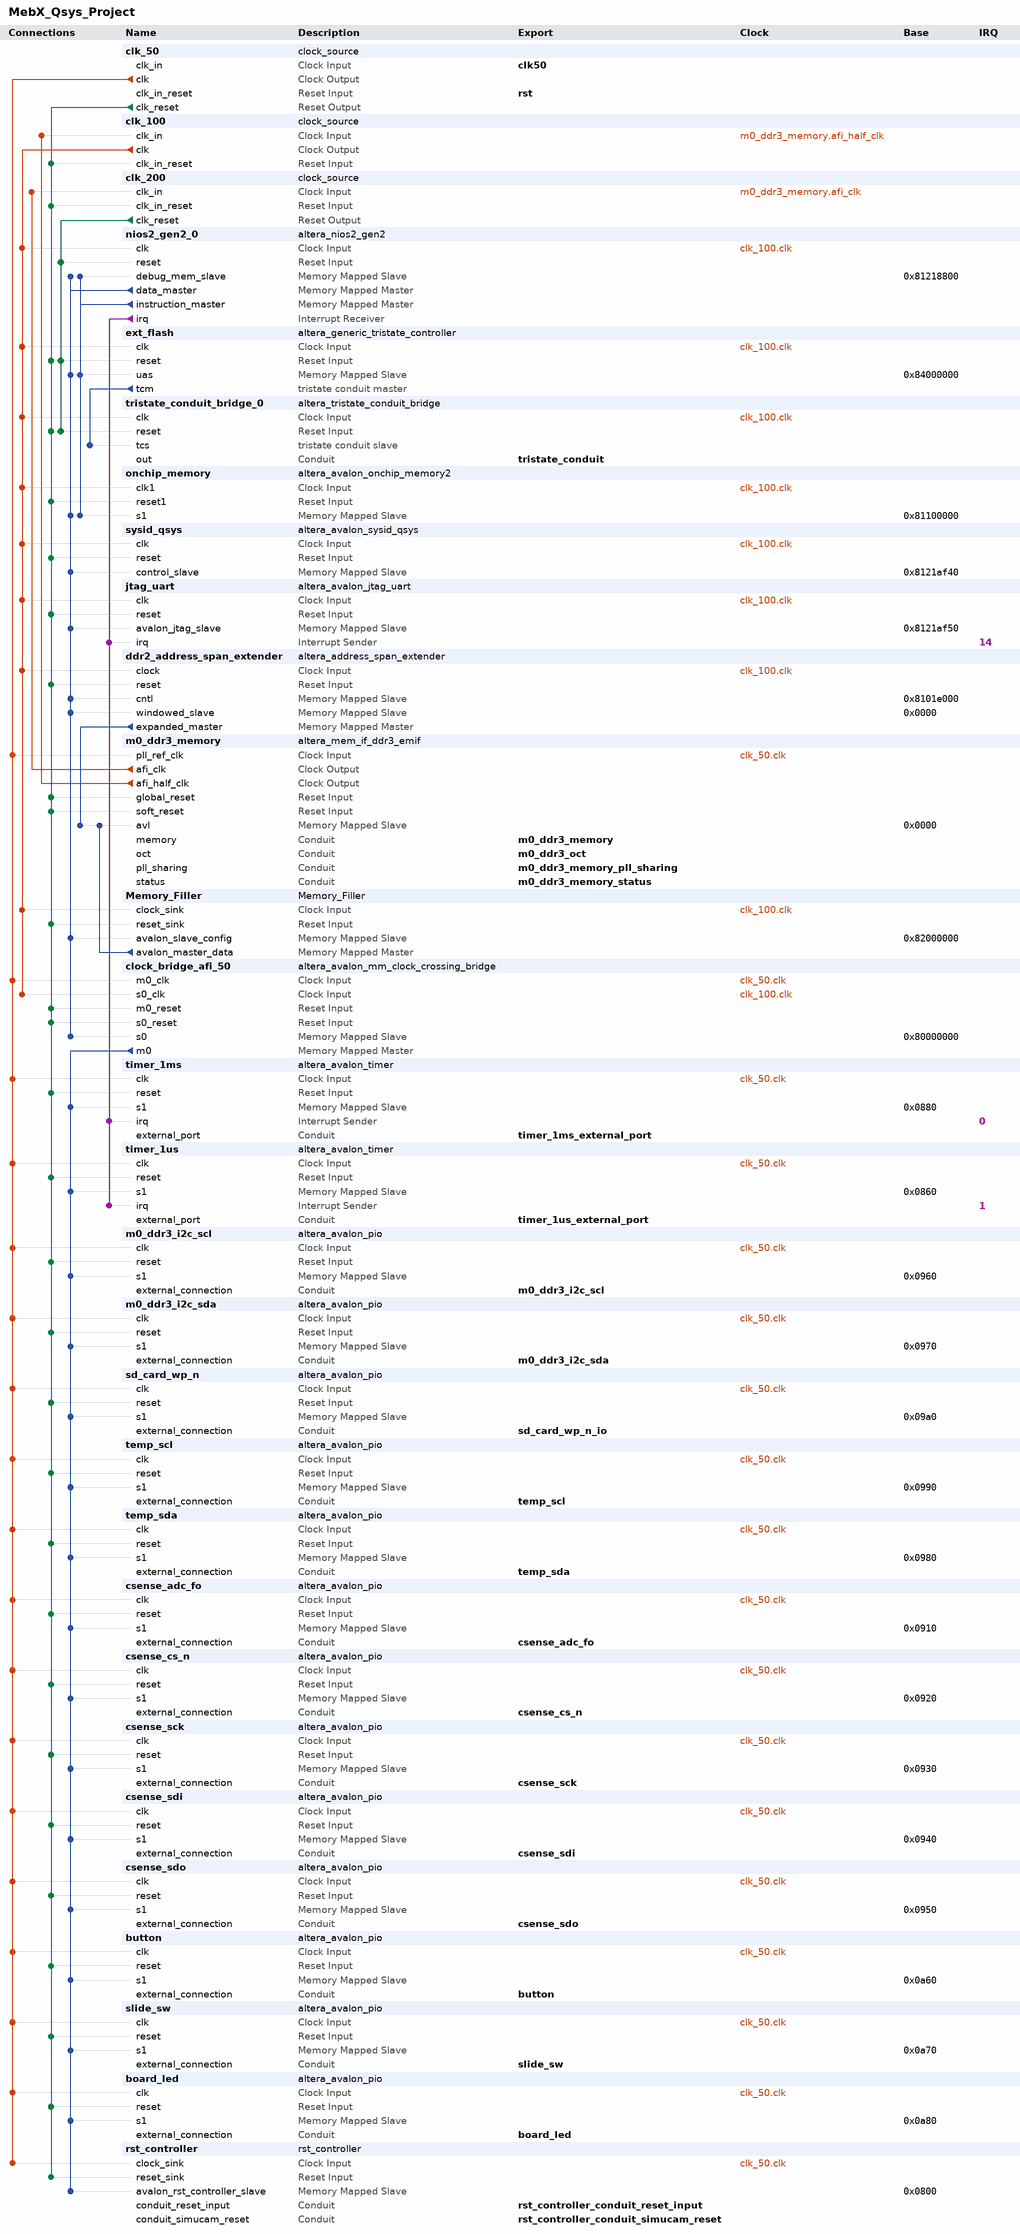
[diagram p0: system contents]
# Platform Designer (Qsys) system MebX_Qsys_Project, Stratix IV EP4SGX530KH40C2
# Parameters at their usual value, and those the tool derives, are not listed.
package require -exact qsys 18.1
create_system MebX_Qsys_Project
set_project_property DEVICE_FAMILY {Stratix IV}
set_project_property DEVICE EP4SGX530KH40C2

add_instance clk_50 clock_source 18.1
set_instance_parameter_value clk_50 clockFrequency 50000000

add_instance clk_100 clock_source 18.1
set_instance_parameter_value clk_100 clockFrequency 100000000

add_instance clk_200 clock_source 18.1
set_instance_parameter_value clk_200 clockFrequency 200000000

add_instance nios2_gen2_0 altera_nios2_gen2 18.1
set_instance_parameter_value nios2_gen2_0 dcache_size 0
set_instance_parameter_value nios2_gen2_0 debug_hwbreakpoint 2
set_instance_parameter_value nios2_gen2_0 dividerType srt2
set_instance_parameter_value nios2_gen2_0 exceptionSlave onchip_memory.s1
set_instance_parameter_value nios2_gen2_0 icache_burstType Sequential
set_instance_parameter_value nios2_gen2_0 icache_size 4096
set_instance_parameter_value nios2_gen2_0 impl Fast
set_instance_parameter_value nios2_gen2_0 mul_64_impl 1
set_instance_parameter_value nios2_gen2_0 mul_shift_choice 1
set_instance_parameter_value nios2_gen2_0 resetOffset 33685504
set_instance_parameter_value nios2_gen2_0 resetSlave ext_flash.uas
set_instance_parameter_value nios2_gen2_0 setting_support31bitdcachebypass false

add_instance ext_flash altera_generic_tristate_controller 18.1
set_instance_parameter_value ext_flash ACTIVE_LOW_BEGINTRANSFER 0
set_instance_parameter_value ext_flash ACTIVE_LOW_BYTEENABLE 0
set_instance_parameter_value ext_flash ACTIVE_LOW_OUTPUTENABLE 0
set_instance_parameter_value ext_flash ACTIVE_LOW_READ 1
set_instance_parameter_value ext_flash CHIPSELECT_THROUGH_READLATENCY 0
set_instance_parameter_value ext_flash INTERFACE_ASSIGNMENT_KEYS embeddedsw.configuration.isFlash,embeddedsw.configuration.isNonVolatileStorage,embeddedsw.configuration.isMemoryDevice
set_instance_parameter_value ext_flash INTERFACE_ASSIGNMENT_VALUES 1,1,1
set_instance_parameter_value ext_flash MODULE_ASSIGNMENT_KEYS embeddedsw.configuration.hwClassnameDriverSupportList,embeddedsw.configuration.hwClassnameDriverSupportDefault,embeddedsw.CMacro.SETUP_VALUE,embeddedsw.CMacro.WAIT_VALUE,embeddedsw.CMacro.HOLD_VALUE,embeddedsw.CMacro.TIMING_UNITS,embeddedsw.CMacro.SIZE,embeddedsw.memoryInfo.MEM_INIT_DATA_WIDTH,embeddedsw.memoryInfo.HAS_BYTE_LANE,embeddedsw.memoryInfo.IS_FLASH,embeddedsw.memoryInfo.GENERATE_DAT_SYM,embeddedsw.memoryInfo.GENERATE_FLASH,embeddedsw.memoryInfo.DAT_SYM_INSTALL_DIR,embeddedsw.memoryInfo.FLASH_INSTALL_DIR
set_instance_parameter_value ext_flash MODULE_ASSIGNMENT_VALUES "altera_avalon_lan91c111\\,altera_avalon_cfi_flash,altera_avalon_cfi_flash,25,100,20,\"ns\",33554432u,16,1,1,1,1,SIM_DIR,APP_DIR"
set_instance_parameter_value ext_flash TCM_ADDRESS_W 26
set_instance_parameter_value ext_flash TCM_BYTEENABLE_W 2
set_instance_parameter_value ext_flash TCM_DATA_HOLD 20
set_instance_parameter_value ext_flash TCM_DATA_W 16
set_instance_parameter_value ext_flash TCM_MAX_PENDING_READ_TRANSACTIONS 3
set_instance_parameter_value ext_flash TCM_READLATENCY 2
set_instance_parameter_value ext_flash TCM_READ_WAIT 100
set_instance_parameter_value ext_flash TCM_SETUP_WAIT 25
set_instance_parameter_value ext_flash TCM_SYMBOLS_PER_WORD 2
set_instance_parameter_value ext_flash TCM_TIMING_UNITS 0
set_instance_parameter_value ext_flash TCM_TURNAROUND_TIME 2
set_instance_parameter_value ext_flash TCM_WRITE_WAIT 100
set_instance_parameter_value ext_flash USE_BEGINTRANSFER 0
set_instance_parameter_value ext_flash USE_BYTEENABLE 0
set_instance_parameter_value ext_flash USE_OUTPUTENABLE 0
set_instance_parameter_value ext_flash USE_READ 1

add_instance tristate_conduit_bridge_0 altera_tristate_conduit_bridge 18.1

add_instance onchip_memory altera_avalon_onchip_memory2 18.1
set_instance_parameter_value onchip_memory blockType M9K
set_instance_parameter_value onchip_memory dataWidth 32
set_instance_parameter_value onchip_memory dualPort false
set_instance_parameter_value onchip_memory initMemContent false
set_instance_parameter_value onchip_memory initializationFileName onchip_mem.hex
set_instance_parameter_value onchip_memory memorySize 786432

add_instance sysid_qsys altera_avalon_sysid_qsys 18.1
set_instance_parameter_value sysid_qsys id 113

add_instance jtag_uart altera_avalon_jtag_uart 18.1
set_instance_parameter_value jtag_uart simInteractiveOptions NO_INTERACTIVE_WINDOWS

add_instance ddr2_address_span_extender altera_address_span_extender 18.1
set_instance_parameter_value ddr2_address_span_extender BURSTCOUNT_WIDTH 8
set_instance_parameter_value ddr2_address_span_extender DATA_WIDTH 32
set_instance_parameter_value ddr2_address_span_extender ENABLE_SLAVE_PORT true
set_instance_parameter_value ddr2_address_span_extender MASTER_ADDRESS_DEF 0
set_instance_parameter_value ddr2_address_span_extender MAX_PENDING_READS 8
set_instance_parameter_value ddr2_address_span_extender SLAVE_ADDRESS_WIDTH 29

add_instance m0_ddr3_memory altera_mem_if_ddr3_emif 18.1
set_instance_parameter_value m0_ddr3_memory AVL_MAX_SIZE 8
set_instance_parameter_value m0_ddr3_memory CALIBRATION_MODE Full
set_instance_parameter_value m0_ddr3_memory CPORT_TYPE_PORT Bidirectional,Bidirectional,Bidirectional,Bidirectional,Bidirectional,Bidirectional
set_instance_parameter_value m0_ddr3_memory EXPORT_AFI_HALF_CLK true
set_instance_parameter_value m0_ddr3_memory HARD_EMIF false
set_instance_parameter_value m0_ddr3_memory MEM_ASR Automatic
set_instance_parameter_value m0_ddr3_memory MEM_ATCL CL-1
set_instance_parameter_value m0_ddr3_memory MEM_BANKADDR_WIDTH 3
set_instance_parameter_value m0_ddr3_memory MEM_CK_WIDTH 2
set_instance_parameter_value m0_ddr3_memory MEM_CLK_FREQ 533.33
set_instance_parameter_value m0_ddr3_memory MEM_CLK_FREQ_MAX 533.333
set_instance_parameter_value m0_ddr3_memory MEM_COL_ADDR_WIDTH 10
set_instance_parameter_value m0_ddr3_memory MEM_DQ_WIDTH 64
set_instance_parameter_value m0_ddr3_memory MEM_FORMAT UNBUFFERED
set_instance_parameter_value m0_ddr3_memory MEM_ROW_ADDR_WIDTH 15
set_instance_parameter_value m0_ddr3_memory MEM_TCL 7
set_instance_parameter_value m0_ddr3_memory MEM_TFAW_NS 37.5
set_instance_parameter_value m0_ddr3_memory MEM_TRAS_NS 37.5
set_instance_parameter_value m0_ddr3_memory MEM_TRCD_NS 13.125
set_instance_parameter_value m0_ddr3_memory MEM_TRFC_NS 110.0
set_instance_parameter_value m0_ddr3_memory MEM_TRP_NS 13.125
set_instance_parameter_value m0_ddr3_memory MEM_TRRD_NS 13.2
set_instance_parameter_value m0_ddr3_memory MEM_TRTP_NS 13.2
set_instance_parameter_value m0_ddr3_memory MEM_TWTR 4
set_instance_parameter_value m0_ddr3_memory MEM_VENDOR Hynix
set_instance_parameter_value m0_ddr3_memory MEM_WTCL 6
set_instance_parameter_value m0_ddr3_memory PLL_LOCATION Top_Bottom
set_instance_parameter_value m0_ddr3_memory POWER_OF_TWO_BUS false
set_instance_parameter_value m0_ddr3_memory PRIORITY_PORT 1,1,1,1,1,1
set_instance_parameter_value m0_ddr3_memory RATE Half
set_instance_parameter_value m0_ddr3_memory REF_CLK_FREQ 50.0
set_instance_parameter_value m0_ddr3_memory SPEED_GRADE 2
set_instance_parameter_value m0_ddr3_memory TIMING_BOARD_AC_SKEW 0.043
set_instance_parameter_value m0_ddr3_memory TIMING_BOARD_AC_TO_CK_SKEW 0.0
set_instance_parameter_value m0_ddr3_memory TIMING_BOARD_DQ_TO_DQS_SKEW 0.004
set_instance_parameter_value m0_ddr3_memory TIMING_BOARD_MAX_CK_DELAY 1.2
set_instance_parameter_value m0_ddr3_memory TIMING_BOARD_MAX_DQS_DELAY 0.56
set_instance_parameter_value m0_ddr3_memory TIMING_BOARD_SKEW_BETWEEN_DQS 0.05
set_instance_parameter_value m0_ddr3_memory TIMING_BOARD_SKEW_CKDQS_DIMM_MAX 0.7
set_instance_parameter_value m0_ddr3_memory TIMING_BOARD_SKEW_CKDQS_DIMM_MIN 0.33
set_instance_parameter_value m0_ddr3_memory TIMING_BOARD_SKEW_WITHIN_DQS 0.0085
set_instance_parameter_value m0_ddr3_memory TIMING_TDH 100
set_instance_parameter_value m0_ddr3_memory TIMING_TDQSCK 400
set_instance_parameter_value m0_ddr3_memory TIMING_TDQSQ 150
set_instance_parameter_value m0_ddr3_memory TIMING_TDQSS 0.25
set_instance_parameter_value m0_ddr3_memory TIMING_TDS 25
set_instance_parameter_value m0_ddr3_memory TIMING_TDSH 0.2
set_instance_parameter_value m0_ddr3_memory TIMING_TDSS 0.2
set_instance_parameter_value m0_ddr3_memory TIMING_TIH 200
set_instance_parameter_value m0_ddr3_memory TIMING_TIS 125
set_instance_parameter_value m0_ddr3_memory TIMING_TQSH 0.38
set_instance_parameter_value m0_ddr3_memory USER_DEBUG_LEVEL 0

add_instance Memory_Filler Memory_Filler 1.0

add_instance clock_bridge_afi_50 altera_avalon_mm_clock_crossing_bridge 18.1
set_instance_parameter_value clock_bridge_afi_50 ADDRESS_WIDTH 32
set_instance_parameter_value clock_bridge_afi_50 COMMAND_FIFO_DEPTH 4
set_instance_parameter_value clock_bridge_afi_50 DATA_WIDTH 32
set_instance_parameter_value clock_bridge_afi_50 MASTER_SYNC_DEPTH 2
set_instance_parameter_value clock_bridge_afi_50 MAX_BURST_SIZE 1
set_instance_parameter_value clock_bridge_afi_50 RESPONSE_FIFO_DEPTH 4
set_instance_parameter_value clock_bridge_afi_50 SLAVE_SYNC_DEPTH 2
set_instance_parameter_value clock_bridge_afi_50 USE_AUTO_ADDRESS_WIDTH 1

add_instance timer_1ms altera_avalon_timer 18.1
set_instance_parameter_value timer_1ms alwaysRun true
set_instance_parameter_value timer_1ms period 1
set_instance_parameter_value timer_1ms periodUnits MSEC
set_instance_parameter_value timer_1ms timeoutPulseOutput true

add_instance timer_1us altera_avalon_timer 18.1
set_instance_parameter_value timer_1us alwaysRun true
set_instance_parameter_value timer_1us period 1
set_instance_parameter_value timer_1us periodUnits USEC
set_instance_parameter_value timer_1us timeoutPulseOutput true

add_instance m0_ddr3_i2c_scl altera_avalon_pio 18.1
set_instance_parameter_value m0_ddr3_i2c_scl direction Output
set_instance_parameter_value m0_ddr3_i2c_scl width 1

add_instance m0_ddr3_i2c_sda altera_avalon_pio 18.1
set_instance_parameter_value m0_ddr3_i2c_sda direction Bidir
set_instance_parameter_value m0_ddr3_i2c_sda width 1

add_instance sd_card_wp_n altera_avalon_pio 18.1
set_instance_parameter_value sd_card_wp_n direction Input
set_instance_parameter_value sd_card_wp_n width 1

add_instance temp_scl altera_avalon_pio 18.1
set_instance_parameter_value temp_scl direction Output
set_instance_parameter_value temp_scl width 1

add_instance temp_sda altera_avalon_pio 18.1
set_instance_parameter_value temp_sda direction Bidir
set_instance_parameter_value temp_sda width 1

add_instance csense_adc_fo altera_avalon_pio 18.1
set_instance_parameter_value csense_adc_fo direction Output
set_instance_parameter_value csense_adc_fo width 1

add_instance csense_cs_n altera_avalon_pio 18.1
set_instance_parameter_value csense_cs_n direction Output
set_instance_parameter_value csense_cs_n width 2

add_instance csense_sck altera_avalon_pio 18.1
set_instance_parameter_value csense_sck direction Output
set_instance_parameter_value csense_sck width 1

add_instance csense_sdi altera_avalon_pio 18.1
set_instance_parameter_value csense_sdi direction Output
set_instance_parameter_value csense_sdi width 1

add_instance csense_sdo altera_avalon_pio 18.1
set_instance_parameter_value csense_sdo direction Input
set_instance_parameter_value csense_sdo width 1

add_instance button altera_avalon_pio 18.1
set_instance_parameter_value button direction Input
set_instance_parameter_value button width 4

add_instance slide_sw altera_avalon_pio 18.1
set_instance_parameter_value slide_sw direction Input
set_instance_parameter_value slide_sw width 4

add_instance board_led altera_avalon_pio 18.1
set_instance_parameter_value board_led direction Output
set_instance_parameter_value board_led resetValue 15
set_instance_parameter_value board_led width 4

add_instance rst_controller rst_controller 1.6

# connections
add_connection clk_50.clk board_led.clk clock
add_connection clk_50.clk button.clk clock
add_connection clk_50.clk clock_bridge_afi_50.m0_clk clock
add_connection clk_50.clk csense_adc_fo.clk clock
add_connection clk_50.clk csense_cs_n.clk clock
add_connection clk_50.clk csense_sck.clk clock
add_connection clk_50.clk csense_sdi.clk clock
add_connection clk_50.clk csense_sdo.clk clock
add_connection clk_50.clk m0_ddr3_i2c_scl.clk clock
add_connection clk_50.clk m0_ddr3_i2c_sda.clk clock
add_connection clk_50.clk m0_ddr3_memory.pll_ref_clk clock
add_connection clk_50.clk rst_controller.clock_sink clock
add_connection clk_50.clk sd_card_wp_n.clk clock
add_connection clk_50.clk slide_sw.clk clock
add_connection clk_50.clk temp_scl.clk clock
add_connection clk_50.clk temp_sda.clk clock
add_connection clk_50.clk timer_1ms.clk clock
add_connection clk_50.clk timer_1us.clk clock
add_connection clk_100.clk clock_bridge_afi_50.s0_clk clock
add_connection clk_100.clk ddr2_address_span_extender.clock clock
add_connection clk_100.clk ext_flash.clk clock
add_connection clk_100.clk jtag_uart.clk clock
add_connection clk_100.clk Memory_Filler.clock_sink clock
add_connection clk_100.clk nios2_gen2_0.clk clock
add_connection clk_100.clk onchip_memory.clk1 clock
add_connection clk_100.clk sysid_qsys.clk clock
add_connection clk_100.clk tristate_conduit_bridge_0.clk clock
add_connection m0_ddr3_memory.afi_clk clk_200.clk_in clock
add_connection m0_ddr3_memory.afi_half_clk clk_100.clk_in clock
add_connection clk_50.clk_reset board_led.reset reset
add_connection clk_50.clk_reset button.reset reset
add_connection clk_50.clk_reset clk_100.clk_in_reset reset
add_connection clk_50.clk_reset clk_200.clk_in_reset reset
add_connection clk_50.clk_reset clock_bridge_afi_50.m0_reset reset
add_connection clk_50.clk_reset clock_bridge_afi_50.s0_reset reset
add_connection clk_50.clk_reset csense_adc_fo.reset reset
add_connection clk_50.clk_reset csense_cs_n.reset reset
add_connection clk_50.clk_reset csense_sck.reset reset
add_connection clk_50.clk_reset csense_sdi.reset reset
add_connection clk_50.clk_reset csense_sdo.reset reset
add_connection clk_50.clk_reset ddr2_address_span_extender.reset reset
add_connection clk_50.clk_reset ext_flash.reset reset
add_connection clk_50.clk_reset jtag_uart.reset reset
add_connection clk_50.clk_reset m0_ddr3_i2c_scl.reset reset
add_connection clk_50.clk_reset m0_ddr3_i2c_sda.reset reset
add_connection clk_50.clk_reset m0_ddr3_memory.global_reset reset
add_connection clk_50.clk_reset m0_ddr3_memory.soft_reset reset
add_connection clk_50.clk_reset Memory_Filler.reset_sink reset
add_connection clk_50.clk_reset onchip_memory.reset1 reset
add_connection clk_50.clk_reset rst_controller.reset_sink reset
add_connection clk_50.clk_reset sd_card_wp_n.reset reset
add_connection clk_50.clk_reset slide_sw.reset reset
add_connection clk_50.clk_reset sysid_qsys.reset reset
add_connection clk_50.clk_reset temp_scl.reset reset
add_connection clk_50.clk_reset temp_sda.reset reset
add_connection clk_50.clk_reset timer_1ms.reset reset
add_connection clk_50.clk_reset timer_1us.reset reset
add_connection clk_50.clk_reset tristate_conduit_bridge_0.reset reset
add_connection clk_200.clk_reset ext_flash.reset reset
add_connection clk_200.clk_reset nios2_gen2_0.reset reset
add_connection clk_200.clk_reset tristate_conduit_bridge_0.reset reset
add_connection clock_bridge_afi_50.m0 board_led.s1 avalon
set_connection_parameter_value clock_bridge_afi_50.m0/board_led.s1 baseAddress 0x0a80
add_connection clock_bridge_afi_50.m0 button.s1 avalon
set_connection_parameter_value clock_bridge_afi_50.m0/button.s1 baseAddress 0x0a60
add_connection clock_bridge_afi_50.m0 csense_adc_fo.s1 avalon
set_connection_parameter_value clock_bridge_afi_50.m0/csense_adc_fo.s1 baseAddress 0x0910
add_connection clock_bridge_afi_50.m0 csense_cs_n.s1 avalon
set_connection_parameter_value clock_bridge_afi_50.m0/csense_cs_n.s1 baseAddress 0x0920
add_connection clock_bridge_afi_50.m0 csense_sck.s1 avalon
set_connection_parameter_value clock_bridge_afi_50.m0/csense_sck.s1 baseAddress 0x0930
add_connection clock_bridge_afi_50.m0 csense_sdi.s1 avalon
set_connection_parameter_value clock_bridge_afi_50.m0/csense_sdi.s1 baseAddress 0x0940
add_connection clock_bridge_afi_50.m0 csense_sdo.s1 avalon
set_connection_parameter_value clock_bridge_afi_50.m0/csense_sdo.s1 baseAddress 0x0950
add_connection clock_bridge_afi_50.m0 m0_ddr3_i2c_scl.s1 avalon
set_connection_parameter_value clock_bridge_afi_50.m0/m0_ddr3_i2c_scl.s1 baseAddress 0x0960
add_connection clock_bridge_afi_50.m0 m0_ddr3_i2c_sda.s1 avalon
set_connection_parameter_value clock_bridge_afi_50.m0/m0_ddr3_i2c_sda.s1 baseAddress 0x0970
add_connection clock_bridge_afi_50.m0 rst_controller.avalon_rst_controller_slave avalon
set_connection_parameter_value clock_bridge_afi_50.m0/rst_controller.avalon_rst_controller_slave baseAddress 0x0800
add_connection clock_bridge_afi_50.m0 sd_card_wp_n.s1 avalon
set_connection_parameter_value clock_bridge_afi_50.m0/sd_card_wp_n.s1 baseAddress 0x09a0
add_connection clock_bridge_afi_50.m0 slide_sw.s1 avalon
set_connection_parameter_value clock_bridge_afi_50.m0/slide_sw.s1 baseAddress 0x0a70
add_connection clock_bridge_afi_50.m0 temp_scl.s1 avalon
set_connection_parameter_value clock_bridge_afi_50.m0/temp_scl.s1 baseAddress 0x0990
add_connection clock_bridge_afi_50.m0 temp_sda.s1 avalon
set_connection_parameter_value clock_bridge_afi_50.m0/temp_sda.s1 baseAddress 0x0980
add_connection clock_bridge_afi_50.m0 timer_1ms.s1 avalon
set_connection_parameter_value clock_bridge_afi_50.m0/timer_1ms.s1 baseAddress 0x0880
add_connection clock_bridge_afi_50.m0 timer_1us.s1 avalon
set_connection_parameter_value clock_bridge_afi_50.m0/timer_1us.s1 baseAddress 0x0860
add_connection ddr2_address_span_extender.expanded_master m0_ddr3_memory.avl avalon
set_connection_parameter_value ddr2_address_span_extender.expanded_master/m0_ddr3_memory.avl baseAddress 0x0000
add_connection Memory_Filler.avalon_master_data m0_ddr3_memory.avl avalon
set_connection_parameter_value Memory_Filler.avalon_master_data/m0_ddr3_memory.avl baseAddress 0x0000
add_connection nios2_gen2_0.data_master clock_bridge_afi_50.s0 avalon
set_connection_parameter_value nios2_gen2_0.data_master/clock_bridge_afi_50.s0 baseAddress 0x80000000
add_connection nios2_gen2_0.data_master ddr2_address_span_extender.cntl avalon
set_connection_parameter_value nios2_gen2_0.data_master/ddr2_address_span_extender.cntl baseAddress 0x8101e000
add_connection nios2_gen2_0.data_master ddr2_address_span_extender.windowed_slave avalon
set_connection_parameter_value nios2_gen2_0.data_master/ddr2_address_span_extender.windowed_slave baseAddress 0x0000
add_connection nios2_gen2_0.data_master ext_flash.uas avalon
set_connection_parameter_value nios2_gen2_0.data_master/ext_flash.uas baseAddress 0x84000000
add_connection nios2_gen2_0.data_master jtag_uart.avalon_jtag_slave avalon
set_connection_parameter_value nios2_gen2_0.data_master/jtag_uart.avalon_jtag_slave baseAddress 0x8121af50
add_connection nios2_gen2_0.data_master Memory_Filler.avalon_slave_config avalon
set_connection_parameter_value nios2_gen2_0.data_master/Memory_Filler.avalon_slave_config baseAddress 0x82000000
add_connection nios2_gen2_0.data_master nios2_gen2_0.debug_mem_slave avalon
set_connection_parameter_value nios2_gen2_0.data_master/nios2_gen2_0.debug_mem_slave baseAddress 0x81218800
add_connection nios2_gen2_0.data_master onchip_memory.s1 avalon
set_connection_parameter_value nios2_gen2_0.data_master/onchip_memory.s1 baseAddress 0x81100000
add_connection nios2_gen2_0.data_master sysid_qsys.control_slave avalon
set_connection_parameter_value nios2_gen2_0.data_master/sysid_qsys.control_slave baseAddress 0x8121af40
add_connection nios2_gen2_0.instruction_master ext_flash.uas avalon
set_connection_parameter_value nios2_gen2_0.instruction_master/ext_flash.uas baseAddress 0x84000000
add_connection nios2_gen2_0.instruction_master nios2_gen2_0.debug_mem_slave avalon
set_connection_parameter_value nios2_gen2_0.instruction_master/nios2_gen2_0.debug_mem_slave baseAddress 0x81218800
add_connection nios2_gen2_0.instruction_master onchip_memory.s1 avalon
set_connection_parameter_value nios2_gen2_0.instruction_master/onchip_memory.s1 baseAddress 0x81100000
add_connection nios2_gen2_0.irq jtag_uart.irq interrupt
set_connection_parameter_value nios2_gen2_0.irq/jtag_uart.irq irqNumber 14
add_connection nios2_gen2_0.irq timer_1ms.irq interrupt
set_connection_parameter_value nios2_gen2_0.irq/timer_1ms.irq irqNumber 0
add_connection nios2_gen2_0.irq timer_1us.irq interrupt
set_connection_parameter_value nios2_gen2_0.irq/timer_1us.irq irqNumber 1
add_connection ext_flash.tcm tristate_conduit_bridge_0.tcs tristate_conduit

# exported interfaces
add_interface board_led conduit end
set_interface_property board_led EXPORT_OF board_led.external_connection
add_interface button conduit end
set_interface_property button EXPORT_OF button.external_connection
add_interface clk50 clock sink
set_interface_property clk50 EXPORT_OF clk_50.clk_in
add_interface csense_adc_fo conduit end
set_interface_property csense_adc_fo EXPORT_OF csense_adc_fo.external_connection
add_interface csense_cs_n conduit end
set_interface_property csense_cs_n EXPORT_OF csense_cs_n.external_connection
add_interface csense_sck conduit end
set_interface_property csense_sck EXPORT_OF csense_sck.external_connection
add_interface csense_sdi conduit end
set_interface_property csense_sdi EXPORT_OF csense_sdi.external_connection
add_interface csense_sdo conduit end
set_interface_property csense_sdo EXPORT_OF csense_sdo.external_connection
add_interface m0_ddr3_i2c_scl conduit end
set_interface_property m0_ddr3_i2c_scl EXPORT_OF m0_ddr3_i2c_scl.external_connection
add_interface m0_ddr3_i2c_sda conduit end
set_interface_property m0_ddr3_i2c_sda EXPORT_OF m0_ddr3_i2c_sda.external_connection
add_interface m0_ddr3_memory conduit end
set_interface_property m0_ddr3_memory EXPORT_OF m0_ddr3_memory.memory
add_interface m0_ddr3_memory_pll_sharing conduit end
set_interface_property m0_ddr3_memory_pll_sharing EXPORT_OF m0_ddr3_memory.pll_sharing
add_interface m0_ddr3_memory_status conduit end
set_interface_property m0_ddr3_memory_status EXPORT_OF m0_ddr3_memory.status
add_interface m0_ddr3_oct conduit end
set_interface_property m0_ddr3_oct EXPORT_OF m0_ddr3_memory.oct
add_interface rst reset sink
set_interface_property rst EXPORT_OF clk_50.clk_in_reset
add_interface rst_controller_conduit_reset_input conduit end
set_interface_property rst_controller_conduit_reset_input EXPORT_OF rst_controller.conduit_reset_input
add_interface rst_controller_conduit_simucam_reset conduit end
set_interface_property rst_controller_conduit_simucam_reset EXPORT_OF rst_controller.conduit_simucam_reset
add_interface sd_card_wp_n_io conduit end
set_interface_property sd_card_wp_n_io EXPORT_OF sd_card_wp_n.external_connection
add_interface slide_sw conduit end
set_interface_property slide_sw EXPORT_OF slide_sw.external_connection
add_interface temp_scl conduit end
set_interface_property temp_scl EXPORT_OF temp_scl.external_connection
add_interface temp_sda conduit end
set_interface_property temp_sda EXPORT_OF temp_sda.external_connection
add_interface timer_1ms_external_port conduit end
set_interface_property timer_1ms_external_port EXPORT_OF timer_1ms.external_port
add_interface timer_1us_external_port conduit end
set_interface_property timer_1us_external_port EXPORT_OF timer_1us.external_port
add_interface tristate_conduit conduit end
set_interface_property tristate_conduit EXPORT_OF tristate_conduit_bridge_0.out

set_interconnect_requirement {$system} qsys_mm.clockCrossingAdapter HANDSHAKE
set_interconnect_requirement {$system} qsys_mm.insertDefaultSlave FALSE
set_interconnect_requirement {$system} qsys_mm.maxAdditionalLatency 1

save_system MebX_Qsys_Project.qsys
